# Altium project brush_driver.PrjPcb
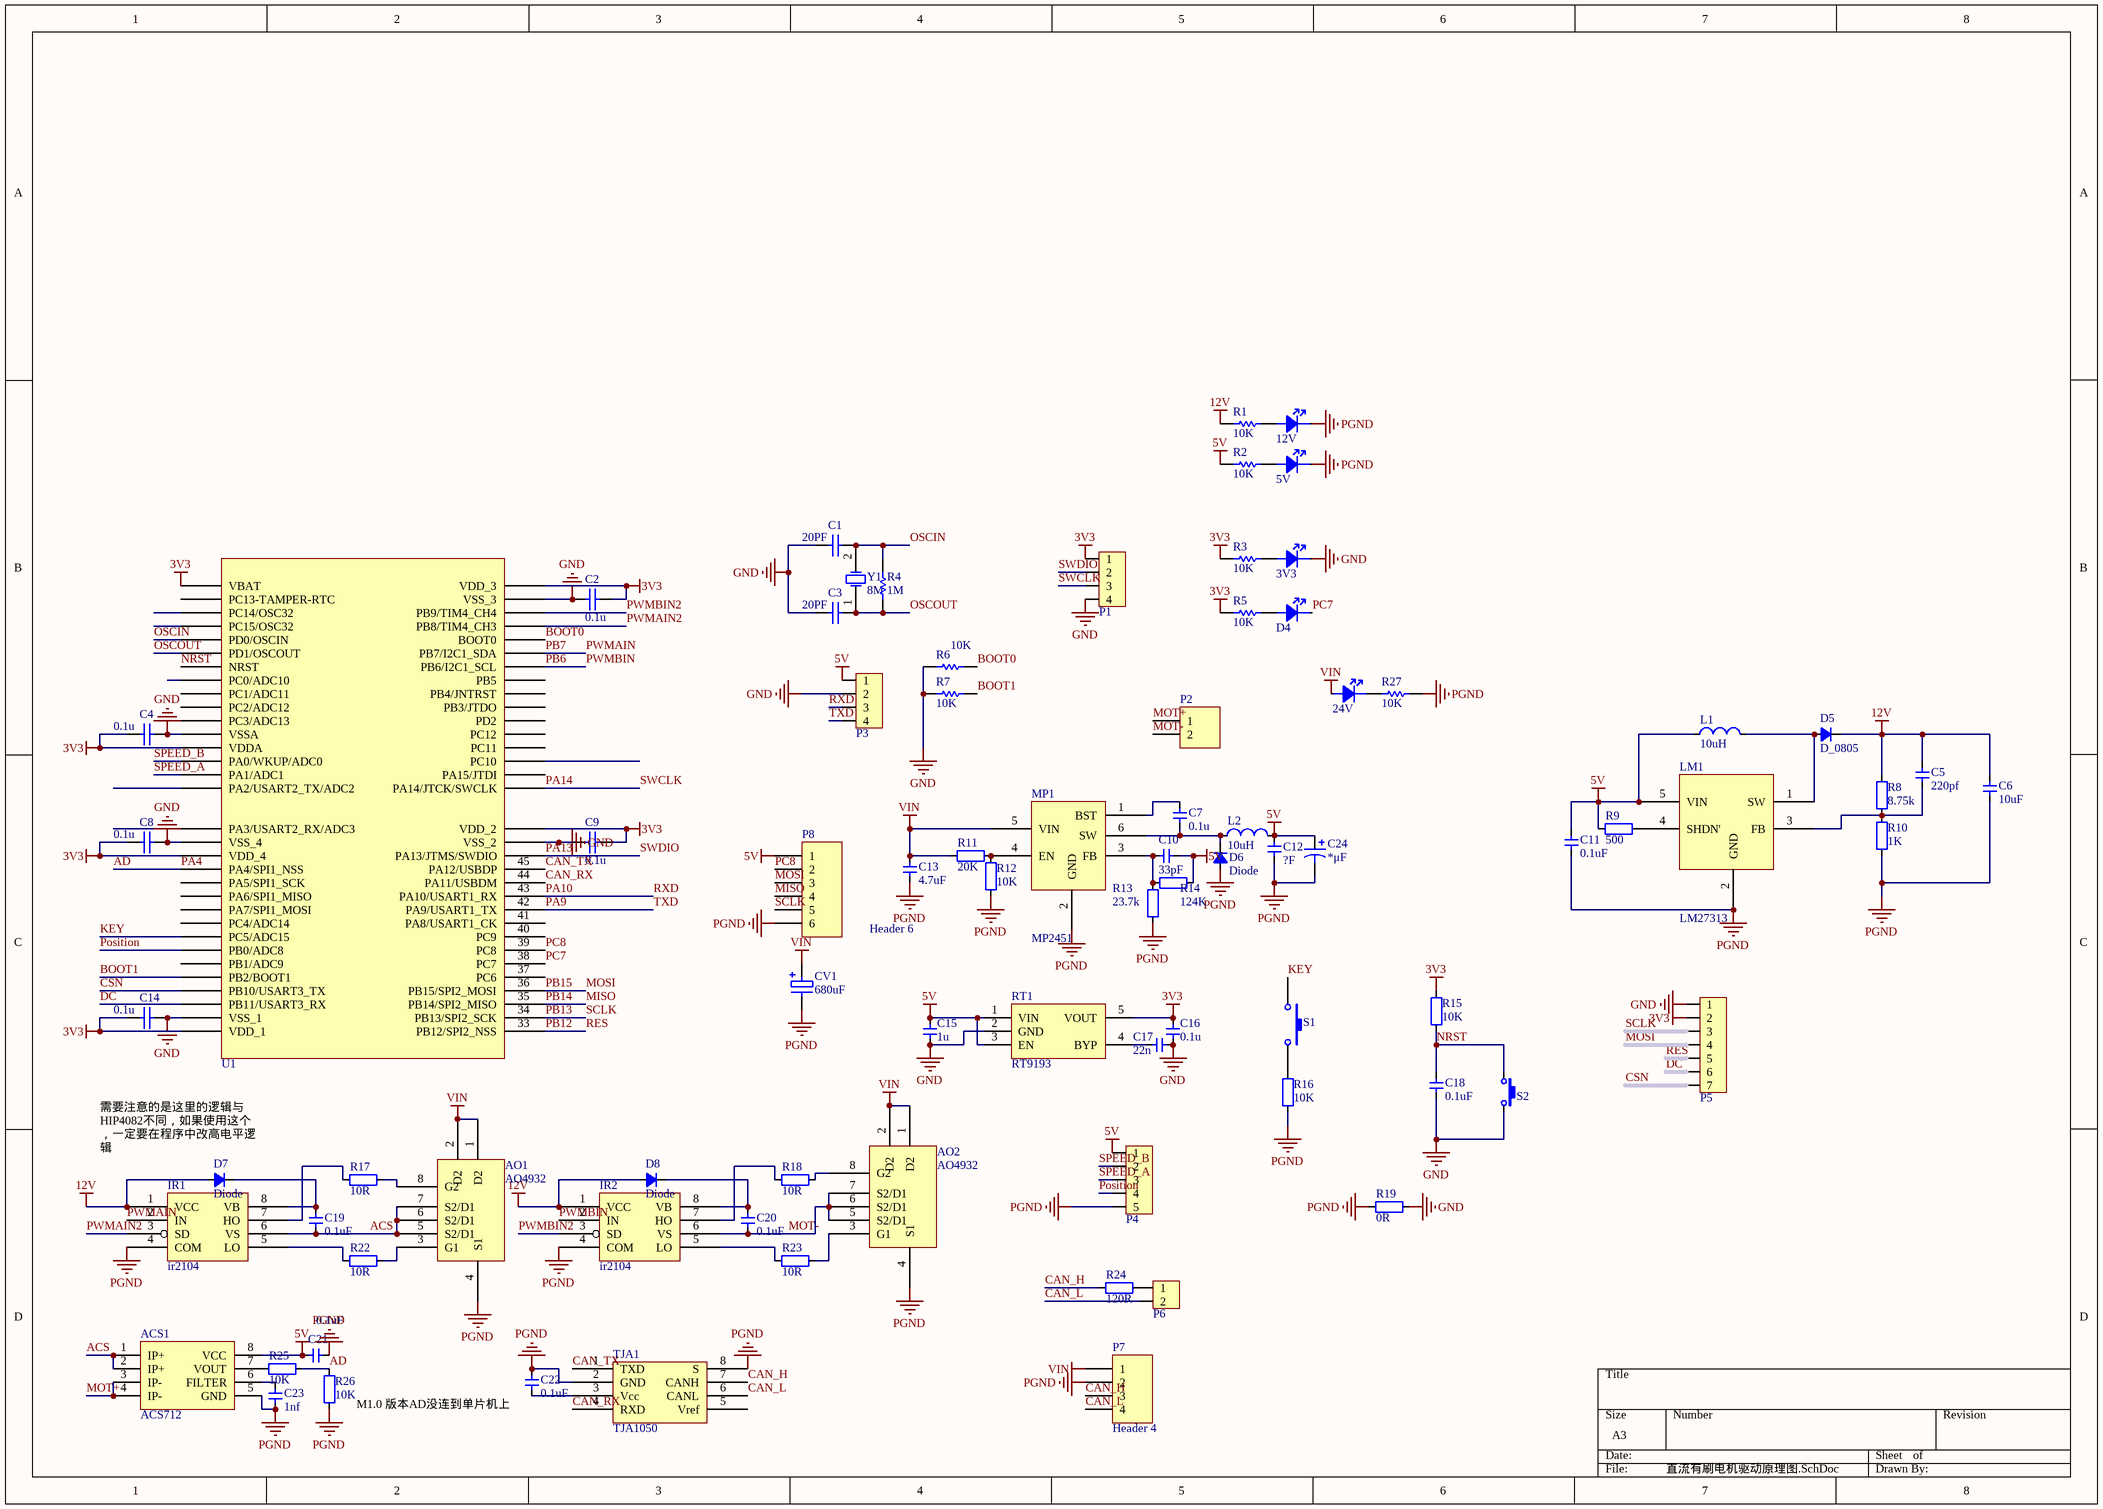
[diagram p0: 直流有刷电机驱动原理图.SchDoc]
1 sheet, 82 parts. Net scope: global (net labels, ports and power ports of the same name join across sheets).
Board file: brush_driver.PcbDoc

## Sheet 直流有刷电机驱动原理图.SchDoc
size A3

### Parts
3V3  lED  [0805D]  (value not drawn)
5V  lED  [0805D]  (value not drawn)
12V  lED  [0805D]  (value not drawn)
24V  lED  [0805D]  (value not drawn)
ACS1  ACS712  [SOP_E150_8]
AO1  AO4932  [SOP_E150_8]
AO2  AO4932  [SOP_E150_8]
C1  value 20PF  [CAP-MLCC-0603]  (hidden comment: Cap)
C2  value 0.1u  [CAP-MLCC-0603]  (hidden comment: Cap)
C3  value 20PF  [CAP-MLCC-0603]  (hidden comment: Cap)
C4  value 0.1u  [CAP-MLCC-0603]  (hidden comment: Cap)
C5  value 220pf  [CAP_0603]  (hidden comment: Cap_0603)
C6  value 10uF  [CAP_0603]  (hidden comment: Cap_0603)
C7  value 0.1u  [CAP_0603]  (hidden comment: Cap_0603)
C8  value 0.1u  [CAP-MLCC-0603]  (hidden comment: Cap)
C9  value 0.1u  [CAP-MLCC-0603]  (hidden comment: Cap)
C10  value 33pF  [CAP_0603]  (hidden comment: Cap_0603)
C11  value 0.1uF  [CAP_0603]  (hidden comment: Cap_0603)
C12  value ?F  [CAP_0603]  (hidden comment: Cap_0603)
C13  value 4.7uF  [CAP-MLCC-1206]  (hidden comment: Cap_0805)
C14  value 0.1u  [CAP-MLCC-0603]  (hidden comment: Cap)
C15  value 1u  [CAP_0603]  (hidden comment: Cap_0603)
C16  value 0.1u  [CAP_0603]  (hidden comment: Cap_0603)
C17  value 22n  [CAP_0603]  (hidden comment: Cap_0603)
C18  value 0.1uF  [CAP_0603]  (hidden comment: Cap_0603)
C19  value 0.1uF  [CAP_0603]  (hidden comment: Cap_0603)
C20  value 0.1uF  [CAP_0603]  (hidden comment: Cap_0603)
C21  value 0.1uF  [CAP_0603]  (hidden comment: Cap_0603)
C22  value 0.1uF  [CAP_0603]  (hidden comment: Cap_0603)
C23  value 1nf  [CAP_0603]  (hidden comment: Cap_0603)
C24  *μF  [CAP-TAN-3216/CAPA]
CV1  680uF  [C_ELE2]
D4  lED  [0805D]  (value not drawn)
D5  D_0805  [LED_0805_YELLOW]
D6  Diode  [LED_0805_RED]
D7  Diode  [LED_0805_RED]
D8  Diode  [LED_0805_RED]
IR1  ir2104  [SOP_E150_8]
IR2  ir2104  [SOP_E150_8]
L1  value 10uH  [IND_CD52]  (hidden comment: Ind_CD32)
L2  value 10uH  [IND_CD52]  (hidden comment: Ind_CD32)
LM1  LM27313  [SOT23-5]
MP1  MP2451  [SOT23-6]
P1  HDR1x4_2.54  [HDR1x4_2.54_180]  (value not drawn)
P2  Header 2  [Green_2P]  (value not drawn)
P3  HDR1x4_2.54  [HDR1x4_2.54_180]  (value not drawn)
P4  HDR1x5_2.54  [HDR1X5_2.54_180]  (value not drawn)
P5  HDR1x7_2.54  [HDR1X7_2.54_180]  (value not drawn)
P6  HDR1x2_2.54  [HDR1X2_2.54_180]  (value not drawn)
P7  Header 4  [Green_4P]
P8  Header 6  [HDR1X6_2.54_180]
R1  value 10K  [RES-0603]  (hidden comment: Res1)
R2  value 10K  [RES-0603]  (hidden comment: Res1)
R3  value 10K  [RES-0603]  (hidden comment: Res1)
R4  value 1M  [RES-0603]  (hidden comment: Res1)
R5  value 10K  [RES-0603]  (hidden comment: Res1)
R6  value 10K  [RES-0603]  (hidden comment: Res1)
R7  value 10K  [RES-0603]  (hidden comment: Res1)
R8  value 8.75k  [RES_0603]  (hidden comment: Res_0603)
R9  value 500  [RES_0603]  (hidden comment: Res_0603)
R10  value 1K  [RES_0603]  (hidden comment: Res_0603)
R11  value 20K  [RES_0603]  (hidden comment: Res_0603)
R12  value 10K  [RES_0603]  (hidden comment: Res_0603)
R13  value 23.7k  [RES_0603]  (hidden comment: Res_0603)
R14  value 124K  [RES_0603]  (hidden comment: Res_0603)
R15  value 10K  [RES_0603]  (hidden comment: Res_0603)
R16  value 10K  [RES_0603]  (hidden comment: Res_0603)
R17  value 10R  [RES_0603]  (hidden comment: Res_0603)
R18  value 10R  [RES_0603]  (hidden comment: Res_0603)
R19  value 0R  [RES_0603]  (hidden comment: Res_0603)
R22  value 10R  [RES_0603]  (hidden comment: Res_0603)
R23  value 10R  [RES_0603]  (hidden comment: Res_0603)
R24  value 120R  [RES_0603]  (hidden comment: Res_0603)
R25  value 10K  [RES_0603]  (hidden comment: Res_0603)
R26  value 10K  [RES_0603]  (hidden comment: Res_0603)
R27  value 10K  [RES-0603]  (hidden comment: Res1)
RT1  RT9193  [SOT23-5]
S1  SW-PB  [key - duplicate]  (value not drawn)
S2  ButtonTACT_3x4x2_180  [ButtonTACT_3x4x2_180H]  (value not drawn)
TJA1  TJA1050  [SOP_E150_8]
U1  STM32F103RC  [LQFP_P0.5_64]  (value not drawn)
Y1  8M  [XT_5032_2]

### Nets
3V3: C2.1 C4.1 C8.1 C9.1 C14.1 C16.2 P1.1 P5.2 R3.2 R5.2 R15.2 RT1.5(VOUT) U1.1(VBAT) U1.13(VDDA) U1.19(VDD_4) U1.32(VDD_1) U1.48(VDD_2) U1.64(VDD_3)
5V: ACS1.8(VCC) C10.1 C11.1 C12.2 C15.2 C21.1 C24.1 L1.1 L2.2 LM1.5(VIN) P3.1 P4.1 P8.1 R2.2 R9.2 R14.2 RT1.1(VIN) RT1.3(EN)
12V: C5.1 C6.2 D5.2(K) D7.1(A) D8.1(A) IR1.1(VCC) IR2.1(VCC) R1.2 R8.1
GND: 3V3.K C1.1 C2.2 C3.1 C4.2 C8.2 C9.2 C14.2 C15.1 C16.1 C17.1 C18.2 P1.4 P3.2 P5.1 R6.2 R7.2 R19.1 RT1.2(GND) S2.2 U1.12(VSSA) U1.18(VSS_4) U1.31(VSS_1) U1.47(VSS_2) U1.63(VSS_3)
PGND: 5V.K 12V.K ACS1.5(GND) AO1.4(S1) AO2.4(S1) C6.1 C11.2 C12.1 C13.1 C21.2 C22.2 C23.2 C24.2 CV1.2 D6.1(A) IR1.4(COM) IR2.4(COM) LM1.2(GND) MP1.2(GND) P4.5 P7.2 P8.6 R10.2 R12.2 R13.2 R16.2 R19.2 R26.1 R27.1 TJA1.2(GND) TJA1.8(S)
VIN: 24V.A AO1.1(D2) AO1.2(D2) AO2.1(D2) AO2.2(D2) C13.2 CV1.1 MP1.5(VIN) P7.1 R11.1
ACS: ACS1.1(IP+) ACS1.2(IP+) AO1.5(S2/D1) AO1.6(S2/D1) AO1.7(S2/D1) C19.2 IR1.6(VS)
AD: R25.2 R26.2 U1.20(PA4/SPI1_NSS)  [also labelled PA4]
BOOT0: R6.1 U1.60(BOOT0)
BOOT1: R7.1 U1.28(PB2/BOOT1)
CAN_H: P7.3 R24.2 TJA1.7(CANH)
CAN_L: P6.2 P7.4 TJA1.6(CANL)
CAN_RX: TJA1.4(RXD) U1.44(PA11/USBDM)
CAN_TX: TJA1.1(TXD) U1.45(PA12/USBDP)
CSN: P5.7 U1.29(PB10/USART3_TX)
DC: P5.6 U1.30(PB11/USART3_RX)
KEY: S1.1 U1.25(PC5/ADC15)
MISO: P8.4 U1.35(PB14/SPI2_MISO)  [also labelled PB14]
MOSI: P5.4 P8.3 U1.36(PB15/SPI2_MOSI)  [also labelled PB15]
MOT+: ACS1.3(IP-) ACS1.4(IP-) P2.1
MOT-: AO2.5(S2/D1) AO2.6(S2/D1) AO2.7(S2/D1) C20.2 IR2.6(VS) P2.2
NRST: C18.1 R15.1 S2.1 U1.7(NRST)
OSCIN: C1.2 R4.2 U1.5(PD0/OSCIN) Y1.2(OSC2)
OSCOUT: C3.2 R4.1 U1.6(PD1/OSCOUT) Y1.1(OSC1)
PA9: P3.4 U1.42(PA9/USART1_TX)  [also labelled TXD]
PA10: P3.3 U1.43(PA10/USART1_RX)  [also labelled RXD]
PA13: P1.2 U1.46(PA13/JTMS/SWDIO)  [also labelled SWDIO]
PA14: P1.3 U1.49(PA14/JTCK/SWCLK)  [also labelled SWCLK]
PB6: IR2.2(IN) U1.58(PB6/I2C1_SCL)  [also labelled PWMBIN]
PB7: IR1.2(IN) U1.59(PB7/I2C1_SDA)  [also labelled PWMAIN]
PB12: P5.5 U1.33(PB12/SPI2_NSS)  [also labelled RES]
PB13: P5.3 P8.5 U1.34(PB13/SPI2_SCK)  [also labelled SCLK]
PC7: D4.K U1.38(PC7)
PC8: P8.2 U1.39(PC8)
Position: P4.4 U1.26(PB0/ADC8)
PWMAIN2: IR1.3(SD) U1.61(PB8/TIM4_CH3)
PWMBIN2: IR2.3(SD) U1.62(PB9/TIM4_CH4)
SPEED_A: P4.3 U1.15(PA1/ADC1)
SPEED_B: P4.2 U1.14(PA0/WKUP/ADC0)
Net3V3_A: 3V3.A R3.1
Net5V_A: 5V.A R2.1
Net12V_A: 12V.A R1.1
Net24V_K: 24V.K R27.2
NetACS1_6: ACS1.6(FILTER) C23.1
NetACS1_7: ACS1.7(VOUT) R25.1
NetAO1_3: AO1.3(G1) R22.2
NetAO1_8: AO1.8(G2) R17.2
NetAO2_3: AO2.3(G1) R23.2
NetAO2_8: AO2.8(G2) R18.2
NetC5_2: C5.2 LM1.3(FB) R8.2 R10.1
NetC7_1: C7.1 D6.2(K) L2.1 MP1.6(SW)
NetC7_2: C7.2 MP1.1(BST)
NetC10_2: C10.2 MP1.3(FB) R13.1 R14.1
NetC17_2: C17.2 RT1.4(BYP)
NetC19_1: C19.1 D7.2(K) IR1.8(VB)
NetC20_1: C20.1 D8.2(K) IR2.8(VB)
NetC22_1: C22.1 TJA1.3(Vcc)
NetD4_A: D4.A R5.1
NetD5_1: D5.1(A) L1.2 LM1.1(SW)
NetIR1_5: IR1.5(LO) R22.1
NetIR1_7: IR1.7(HO) R17.1
NetIR2_5: IR2.5(LO) R23.1
NetIR2_7: IR2.7(HO) R18.1
NetLM1_4: LM1.4(SHDN') R9.1
NetMP1_4: MP1.4(EN) R11.2 R12.1
NetP6_1: P6.1 R24.1
NetR16_1: R16.1 S1.2

Not connected (* = marked no-connect by the designer): TJA1 5(Vref); U1 2(PC13-TAMPER-RTC) 3(PC14/OSC32) 4(PC15/OSC32) 8(PC0/ADC10) 9(PC1/ADC11) 10(PC2/ADC12) 11(PC3/ADC13) 16(PA2/USART2_TX/ADC2) 17(PA3/USART2_RX/ADC3) 21(PA5/SPI1_SCK) 22(PA6/SPI1_MISO) 23(PA7/SPI1_MOSI) 24(PC4/ADC14) 27(PB1/ADC9) 37(PC6) 40(PC9) 41(PA8/USART1_CK) 50(PA15/JTDI) 51(PC10) 52(PC11) 53(PC12) 54(PD2) 55(PB3/JTDO) 56(PB4/JNTRST) 57(PB5)

### Notes on the sheet
- (near D7) 需要注意的是这里的逻辑与HIP4082不同，如果使用这个，一定要在程序中改高电平逻辑
- (near C22) M1.0 版本AD没连到单片机上

### Library data of the parts
3V3 5V 12V 24V D4 = 00-D-LED
ACS1 = ACS712: Sensor Current
C1-C4 C8 C9 C14 = Cap_1: Capacitor; Published: 8-Jun-2000; LatestRevisionDate: 17-Jul-2002; LatestRevisionNote: Re-released for DXP Platform.; PackageReference: RAD-0.3; Publisher: Altium Limited
C5-C7 C10-C12 C15-C23 = Cap_0603: Capacitor
C13 = Cap_0805: Capacitor
C24 = CAP-TAN: 钽电容; Published: 8-Jun-2000; LatestRevisionDate: 17-Jul-2002; LatestRevisionNote: Re-released for DXP Platform.; PackageReference: POLAR0.8; Publisher: Altium Limited; PackageDescription: Polarized Capacitor; 2 Leads; Value: *μF
CV1 = CAP-ELE: 电解电容; Value: *μF; Published: 8-Jun-2000; LatestRevisionDate: 17-Jul-2002; LatestRevisionNote: Re-released for DXP Platform.; PackageReference: RB7.6-15; Publisher: Altium Limited; PackageDescription: Polarized Capacitor (Radial); 2 Leads
L1 L2 = Ind_CD32: Inductor
P1 P3 = HDR1x4_2.54: Header
P2 = Header 2: Header, 2-Pin; LatestRevisionDate: 17-Jul-2002; LatestRevisionNote: Re-released for DXP Platform.; Publisher: Altium Limited
P4 = HDR1x5_2.54: Header
P5 = HDR1x7_2.54T: Header
P6 = HDR1x2_2.54: Header
P7 = Header 4: Header, 4-Pin; LatestRevisionDate: 17-Jul-2002; LatestRevisionNote: Re-released for DXP Platform.; Publisher: Altium Limited
P8 = Header 6: Header, 6-Pin; LatestRevisionDate: 17-Jul-2002; LatestRevisionNote: Re-released for DXP Platform.; Publisher: Altium Limited
R1-R7 R27 = Res1_1: Resistor; Published: 8-Jun-2000; LatestRevisionDate: 17-Jul-2002; LatestRevisionNote: Re-released for DXP Platform.; PackageReference: AXIAL-0.3; Publisher: Altium Limited
R8-R19 R22-R26 = Res_0603: Resistor
RT1 = RT9193: Power
S1 = SW-PB: Switch; Published: 24-Mar-1999; LatestRevisionDate: 17-Jul-2002; LatestRevisionNote: Re-released for DXP Platform.; PackageReference: SPST-2; Publisher: Altium Limited; PackageDescription: Switch; 2 Leads
S2 = ButtonTACT_3x4x2_180: Button
U1 = STM32F103RC: MCU
Y1 = C-Osc: Crystal Oscillator; Published: 8-Jun-2000; LatestRevisionDate: 17-Jul-2002; LatestRevisionNote: Re-released for DXP Platform.; PackageReference: R38; Publisher: Altium Limited; PackageDescription: Crystal, Thru-Hole; 2 Leads; Body 3.1 x 8.2 mm (Dia.xH)